# Altium schematic sheet PWR_CHGR.SchDoc
size A4; SheetNumber: 6; SheetTotal: 6; SheetSize: A4; DrawingNumber: SCH-002; SPICEModelCacheCAOXICTU: <root> / <DocumentId>CAOXICTU</DocumentId> / <CacheFrame Number="0"> / <Model Name="led0" Kind="MDL"> / <Text>*Typ INFRARED GaAs LED: Vf=1.2V Vr=5V If=40mA trr=3uS / *LED Pinout: 1=A, 2=K / .MODEL LED0 D (IS=93.5P RS=84M N=2.63 BV=5 IBV=10U / + CJO=2.97P VJ=.75 M=.333 TT=4.32U)</Text> / </Model> / </CacheFrame> / </root>
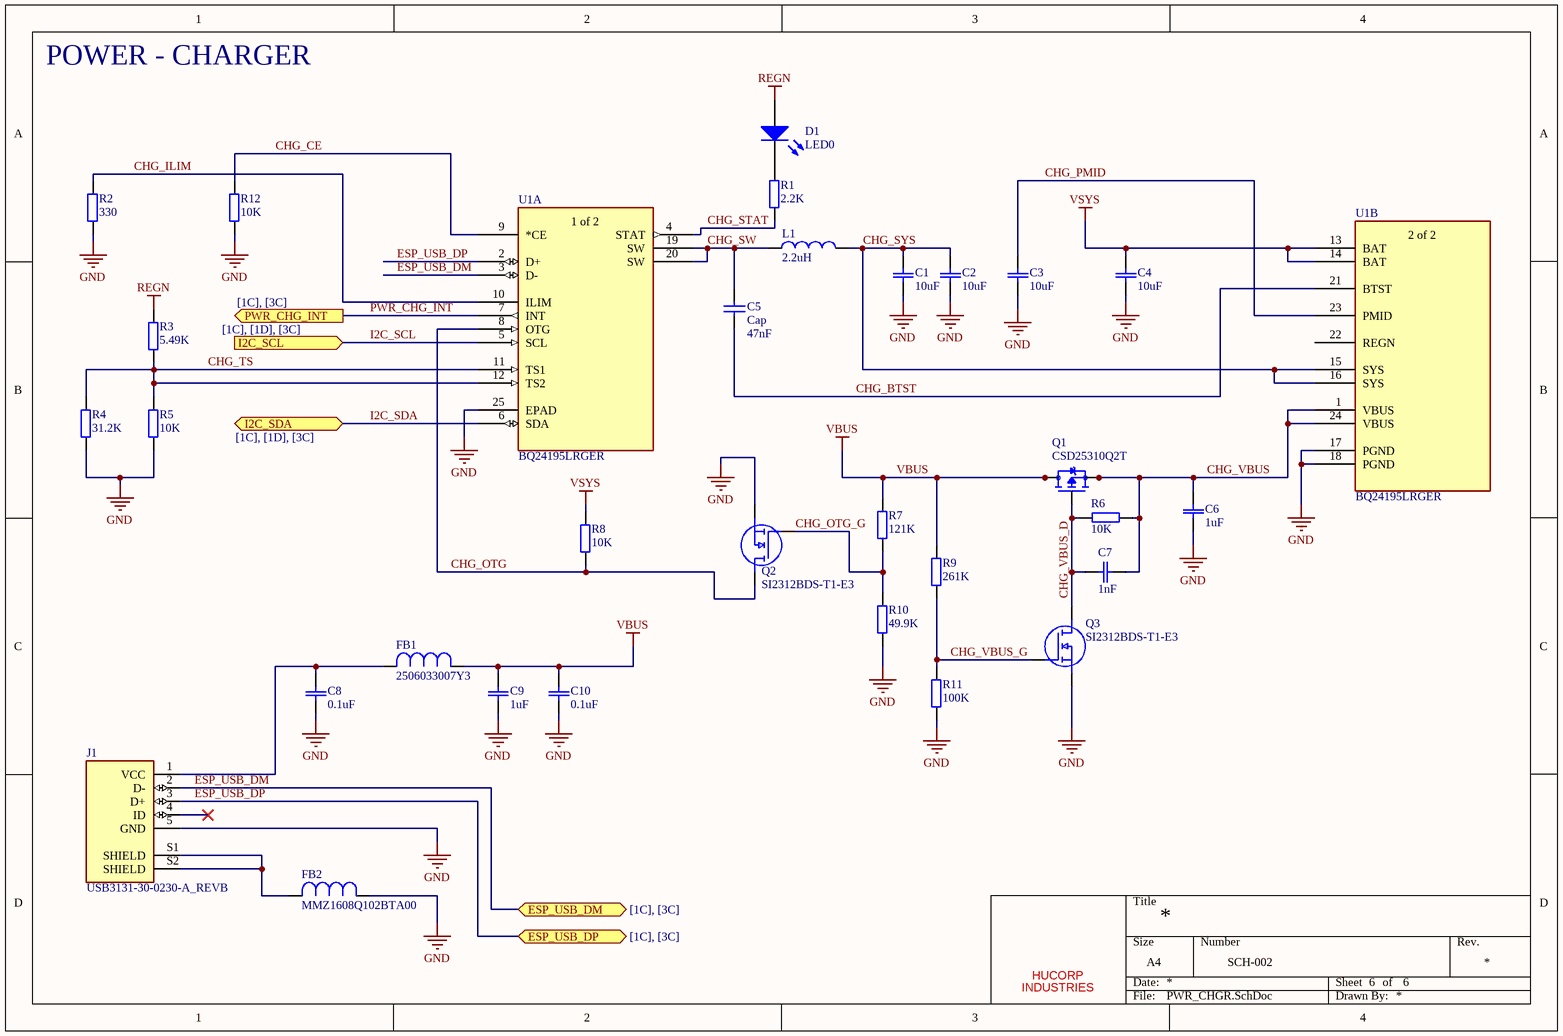
[diagram p0: PWR_CHGR.SchDoc]

## Parts
*  HUCORP  (value not drawn)  (graphical)
C1  value 10uF  [CAP_CL10_SAM]  (hidden comment: 10 uF)
C2  value 10uF  [CAP_CL10_SAM]  (hidden comment: 10 uF)
C3  value 10uF  [CAP_CL10_SAM]  (hidden comment: 10 uF)
C4  value 10uF  [CAP_CL10_SAM]  (hidden comment: 10 uF)
C5  Cap  value 47nF  [RAD-0.3]
C6  1uF  [CAP_CL10_SAM]
C7  value 1nF  [CAP_CL10_SAM]  (hidden comment: 1 nF)
C8  value 0.1uF  [CAP_CL10_SAM]  (hidden comment: 100 nF)
C9  1uF  [CAP_CL10_SAM]
C10  value 0.1uF  [CAP_CL10_SAM]  (hidden comment: 100 nF)
D1  LED0  [LED-0]
FB1  2506033007Y3  [IND_25_0603_FRT]
FB2  MMZ1608Q102BTA00  [IND_1608_TDK]
J1  USB3131-30-0230-A_REVB  [GCT_USB3131-30-0230-A_REVB]
L1  value 2.2uH  [INDC2520X100N]  (hidden comment: DFE252010P-2R2M=P2)
Q1  CSD25310Q2T  [TRANS_CSD25310Q2T]
Q2  SI2312BDS-T1-E3  [SOT95P237X112-3N]
Q3  SI2312BDS-T1-E3  [SOT95P237X112-3N]
R1  value 2.2K  [RC0603N_YAG]  (hidden comment: RC0603FR-072K2L)
R2  value 330  [RES_RC0603_YAG]  (hidden comment: RC0603FR-13330RL)
R3  value 5.49K  [RC0603N_YAG]  (hidden comment: RC0603FR-075K49L)
R4  value 31.2K  [RESC1608X55N]  (hidden comment: RT0603DRE0731K2L)
R5  10K  [RES_RC0603_YAG]
R6  10K  [RES_RC0603_YAG]
R7  value 121K  [RC0603N_YAG]  (hidden comment: RC0603FR-07121KL)
R8  10K  [RES_RC0603_YAG]
R9  value 261K  [RC0603N_YAG]  (hidden comment: RC0603FR-07261KL)
R10  value 49.9K  [RES_RC0603_YAG]  (hidden comment: RC0603FR-1049K9L)
R11  100K  [RC0603N_YAG]
R12  10K  [RES_RC0603_YAG]
U1  BQ24195LRGER  [RGE24_2P7X2P7_TEX]  (parts A,B of 2)

## Ports
ESP_USB_DM (bidir, see [1C], [3C]), ESP_USB_DP (bidir, see [1C], [3C]), I2C_SCL (in, see [1C], [1D], [3C]), I2C_SDA (bidir, see [1C], [1D], [3C]), PWR_CHG_INT (out, see [1C], [3C])

## Nets
GND: C1.1 C2.1 C3.1 C4.1 C6.1 C8.1 C9.1 C10.1 FB2.1 J1.5(GND) Q2.2(S) Q3.2(S) R2.1 R4.1 R5.1 R10.1 R11.1 R12.1 U1.17(PGND) U1.18(PGND) U1.25(EPAD)
REGN: D1.1(A) R3.2
VBUS: C9.2 C10.2 FB1.1 Q1.4(D) Q1.8(D) R7.2 R9.2
VSYS: C4.2 R8.2 U1.13(BAT) U1.14(BAT)
CHG_BTST: C5.1 U1.21(BTST)
CHG_CE: R12.2 U1.9(*CE)
CHG_ILIM: R2.2 U1.10(ILIM)
CHG_OTG: Q2.3(D) R8.1 U1.8(OTG)
CHG_OTG_G: Q2.1(G) R7.1 R10.2
CHG_PMID: C3.2 U1.23(PMID)
CHG_STAT: R1.1 U1.4(STAT)
CHG_SW: C5.2 L1.1 U1.19(SW) U1.20(SW)
CHG_SYS: C1.2 C2.2 L1.2 U1.15(SYS) U1.16(SYS)
CHG_TS: R3.1 R4.2 R5.2 U1.11(TS1) U1.12(TS2)
CHG_VBUS: C6.2 C7.2 Q1.1(S) Q1.2(S) Q1.5(S) Q1.6(S) Q1.7(S) R6.2 U1.1(VBUS) U1.24(VBUS)
CHG_VBUS_D: C7.1 Q1.3(G) Q3.3(D) R6.1
CHG_VBUS_G: Q3.1(G) R9.1 R11.2
ESP_USB_DM: J1.2(D-) U1.3(D-) ; port ESP_USB_DM
ESP_USB_DP: J1.3(D+) U1.2(D+) ; port ESP_USB_DP
I2C_SCL: U1.5(SCL) ; port I2C_SCL
I2C_SDA: U1.6(SDA) ; port I2C_SDA
PWR_CHG_INT: U1.7(INT) ; port PWR_CHG_INT
NetC8_2: C8.2 FB1.2 J1.1(VCC)
NetD1_2: D1.2(K) R1.2
NetFB2_2: FB2.2 J1.S1(SHIELD) J1.S2(SHIELD)

Not connected (* = marked no-connect by the designer): J1 4(ID)*; U1 22(REGN)

## Notes on the sheet
- POWER - CHARGER
- (in symbol BQ24195LRGER, part A) 1 of 2
- (in symbol BQ24195LRGER, part B) 2 of 2
- (in symbol TitleBlock1) Title; Size; Number; Rev.; INDUSTRIES; Date:; Sheet; of; File:; Drawn By:

## Library data of the parts
* = TitleBlock1: HUCORP Title Block
C1-C4 = CL10A106MQ8NNNC: 10 µF ±20% 6.3V Ceramic Capacitor X5R 0603 (1608 Metric); Mfr_Name: Samsung; Type: DEV; Copyright: Copyright (C) 2022 Ultra Librarian. All rights reserved.; Manufacturer_Part_Number: CL10A106MQ8NNNC; Digi-Key_Part_Number_1: 1276-1119-2-ND; Digi-Key_Part_Number_2: 1276-1119-1-ND; Digi-Key_Part_Number_3: 1276-1119-6-ND; RefDes: RefDes
C5 = Cap: Capacitor; Published: 8-Jun-2000; LatestRevisionDate: 17-Jul-2002; LatestRevisionNote: Re-released for DXP Platform.; PackageReference: RAD-0.3; Publisher: Altium Limited; PackageDescription: Radial Cap, Thru-Hole; 2 Leads; 0.3 in Pin Spacing
C6 C9 = CL10A105KA8NNNC: CAP CER 1UF 25V X5R 0603; Mfr_Name: Samsung; Manufacturer_Part_Number: CL10B104KA8NNNC; Type: DEV; Copyright: Copyright (C) 2022 Ultra Librarian. All rights reserved.; Digi-Key_Part_Number_1: 1276-1006-2-ND; Digi-Key_Part_Number_2: 1276-1006-1-ND; Digi-Key_Part_Number_3: 1276-1006-6-ND; RefDes: RefDes; Value: 1uF
C7 = CL10B102KB8NFNC: CAP CER 1nF 50V X7R 0603; Mfr_Name: Samsung; Type: DEV; Copyright: Copyright (C) 2023 Ultra Librarian. All rights reserved.; Manufacturer_Part_Number: CL10B102KB8NFNC; Digi-Key_Part_Number_1: 1276-1914-2-ND; Digi-Key_Part_Number_2: 1276-1914-1-ND; Digi-Key_Part_Number_3: 1276-1914-6-ND; RefDes: RefDes
C8 C10 = CL10B104KA8NNNC: CAP CER 0.1UF 25V X7R 0603; Mfr_Name: Samsung; Type: DEV; Copyright: Copyright (C) 2022 Ultra Librarian. All rights reserved.; Manufacturer_Part_Number: CL10B104KA8NNNC; Digi-Key_Part_Number_1: 1276-1006-2-ND; Digi-Key_Part_Number_2: 1276-1006-1-ND; Digi-Key_Part_Number_3: 1276-1006-6-ND; RefDes: RefDes
D1 = LED0: Typical INFRARED GaAs LED; Published: 8-Jun-2000; LatestRevisionDate: 08-Jul-2005; LatestRevisionNote: Mech Layer 1 removed.; PackageReference: LED-0; Publisher: Altium Limited; PackageDescription: LED; 2 Leads
FB1 = 2506033007Y3: FERRITE BEAD 30 OHM 0603 1LN; Mfr_Name: Fair-Rite; Type: DEV; Copyright: Copyright (C) 2023 Ultra Librarian. All rights reserved.; Manufacturer_Part_Number: 2506033007Y3; Digi-Key_Part_Number_1: 1934-1439-1-ND; Digi-Key_Part_Number_2: 1934-1439-2-ND; Digi-Key_Part_Number_3: 1934-1439-6-ND; RefDes: RefDes
FB2 = MMZ1608Q102BTA00: FERRITE BEAD 1K OHM 0603 1LN; Mfr_Name: TDK; Type: DEV; Copyright: Copyright (C) 2023 Ultra Librarian. All rights reserved.; Manufacturer_Part_Number: MMZ1608Q102BTA00; Digi-Key_Part_Number_1: 445-8680-1-ND; Digi-Key_Part_Number_2: 445-8680-2-ND; Digi-Key_Part_Number_3: 445-8680-6-ND; RefDes: RefDes
J1 = USB3131-30-0230-A_REVB: USB - micro B USB 2.0 Receptacle Connector 5 Position Through Hole; Availability: Unavailable; MP: USB3131-30-0230-A_REVB; Value: *; Package: None; Price: None
L1 = DFE252010P-2R2M=P2: Inductor with Inductance: 2.2uH Tol. +/-20%, Package: 1008 (2520); MF: Murata Electronics; MP: DFE252010P-2R2M=P2; Purchase-URL: https://pricing.snapeda.com/search/part/DFE252010P-2R2M=P2/?ref=eda; Check_prices: https://www.snapeda.com/parts/DFE252010P-2R2M=P2/Murata%20Electronics%20North%20America/view-part/1503972/?ref=eda; Package: 2520 Murata; Availability: Warning; Price: None; SnapEDA_Link: https://www.snapeda.com/parts/DFE252010P-2R2M=P2/Murata%20Electronics%20North%20America/view-part/1503972/?ref=snap
Q1 = CSD25310Q2T: -20V, P ch NexFET MOSFET, single SON 2x2, 23.9mOhm 6-WSON -55 to 150; MF: Texas Instruments; Digi-Key_Part_Number: 296-50290-2-ND; Value: *; Package: WSON-6 Texas Instruments; Purchase-URL: https://pricing.snapeda.com/search/part/CSD25310Q2T/?ref=eda; Check_prices: https://www.snapeda.com/parts/CSD25310Q2T/Texas+Instruments/view-part/?ref=eda; MP: CSD25310Q2T; SnapEDA_Link: https://www.snapeda.com/parts/CSD25310Q2T/Texas+Instruments/view-part/?ref=snap
Q2 Q3 = SI2312BDS-T1-E3: N-Channel 20 V (D-S) MOSFET; Manufacturer_Name: Vishay; Geometry.Height: 1.12mm; Mouser Part Number: 781-SI2312BDS-E3; Mouser Price/Stock: https://www.mouser.co.uk/ProductDetail/Vishay-Semiconductors/SI2312BDS-T1-E3?qs=jcx%252B0HVgj2b3YhM4OoQ%252BrQ%3D%3D; Manufacturer_Part_Number: SI2312BDS-T1-E3; Datasheet Link: http://www.vishay.com/docs/73235/si2312bds.pdf
R1 = RC0603FR-072K2L: RES 2.2K OHM 1% 1/10W 0603; Mfr_Name: Yageo; Copyright: Copyright (C) 2023 Ultra Librarian. All rights reserved.; Manufacturer_Part_Number: RC0603FR-072K2L; Digi-Key_Part_Number_1: 311-2.20KHRCT-ND; Digi-Key_Part_Number_2: 311-2.20KHRDKR-ND; Digi-Key_Part_Number_3: 311-2.20KHRTR-ND; Digi-Key_Part_Number_4: 311-2.20KHRTR-NDL; RefDes: RefDes; Type: DEV
R2 = RC0603FR-13330RL: RES 330 OHM 1% 1/10W 0603; Mfr_Name: Yageo; Copyright: Copyright (C) 2023 Ultra Librarian. All rights reserved.; Manufacturer_Part_Number: RC0603FR-13330RL; Digi-Key_Part_Number_1: 13-RC0603FR-13330RLTR-ND; Digi-Key_Part_Number_2: 13-RC0603FR-13330RLCT-ND; Digi-Key_Part_Number_3: 13-RC0603FR-13330RLDKR-ND; RefDes: RefDes; Type: DEV
R3 = RC0603FR-075K49L: RES 5.49K OHM 1% 1/10W 0603; Mfr_Name: Yageo; Copyright: Copyright (C) 2023 Ultra Librarian. All rights reserved.; Manufacturer_Part_Number: RC0603FR-075K49L; Digi-Key_Part_Number_1: 311-5.49KHRCT-ND; Digi-Key_Part_Number_2: 311-5.49KHRDKR-ND; Digi-Key_Part_Number_3: 311-5.49KHRTR-ND; RefDes: RefDes; Type: DEV
R4 = RT0603DRE0731K2L: RES 31.2K OHM 0.5% 1/10W 0603; Package: None; Price: None; MP: RT0603DRE0731K2L; Availability: Unavailable
R5 R6 R8 R12 = RC0603JR-1310KL: RES 10K OHM 5% 1/10W 0603; Mfr_Name: Yageo; Copyright: Copyright (C) 2022 Ultra Librarian. All rights reserved.; Manufacturer_Part_Number: RC0603JR-1310KL; Digi-Key_Part_Number_1: 13-RC0603JR-1310KLTR-ND; Digi-Key_Part_Number_2: 13-RC0603JR-1310KLCT-ND; Digi-Key_Part_Number_3: 13-RC0603JR-1310KLDKR-ND; RefDes: RefDes; Type: DEV; Value: 10K
R7 = RC0603FR-07121KL: RES 121K OHM 1% 1/10W 0603; Mfr_Name: Yageo; Copyright: Copyright (C) 2023 Ultra Librarian. All rights reserved.; Manufacturer_Part_Number: RC0603FR-07121KL; Digi-Key_Part_Number_1: 311-121KHRCT-ND; Digi-Key_Part_Number_2: 311-121KHRDKR-ND; Digi-Key_Part_Number_3: 311-121KHRTR-ND; RefDes: RefDes; Type: DEV
R9 = RC0603FR-07261KL: RES 261K OHM 1% 1/10W 0603; Mfr_Name: Yageo; Copyright: Copyright (C) 2023 Ultra Librarian. All rights reserved.; Manufacturer_Part_Number: RC0603FR-07261KL; Digi-Key_Part_Number_1: 311-261KHRCT-ND; Digi-Key_Part_Number_2: 311-261KHRDKR-ND; Digi-Key_Part_Number_3: 311-261KHRTR-ND; RefDes: RefDes; Type: DEV
R10 = RC0603FR-1049K9L: RES 49.9K OHM 1% 1/10W 0603; Mfr_Name: Yageo; Copyright: Copyright (C) 2023 Ultra Librarian. All rights reserved.; Manufacturer_Part_Number: RC0603FR-1049K9L; Digi-Key_Part_Number_1: 13-RC0603FR-1049K9LTR-ND; Digi-Key_Part_Number_2: 13-RC0603FR-1049K9LCT-ND; Digi-Key_Part_Number_3: 13-RC0603FR-1049K9LDKR-ND; RefDes: RefDes; Type: DEV
R11 = RC0603FR-07100KL: RES 100K OHM 1% 1/10W 0603; Mfr_Name: Yageo; Copyright: Copyright (C) 2022 Ultra Librarian. All rights reserved.; Manufacturer_Part_Number: RC0603FR-07100KL; Digi-Key_Part_Number_1: 311-100KHRCT-ND; Digi-Key_Part_Number_2: 311-100KHRDKR-ND; Digi-Key_Part_Number_3: 311-100KHRTR-ND; Digi-Key_Part_Number_4: 311-100KHRTR-NDL; RefDes: RefDes; Type: DEV; Value: 100K
U1 = BQ24195LRGER: IC BATT CHG LI-ION 1CELL 24VQFN; Mfr_Name: Texas Instruments; Copyright: Copyright (C) 2023 Ultra Librarian. All rights reserved.; Manufacturer_Part_Number: BQ24195LRGER; Digi-Key_Part_Number_1: 2156-BQ24195LRGER-ND; Digi-Key_Part_Number_2: 296-49149-1-ND; Digi-Key_Part_Number_3: 296-49149-2-ND; Digi-Key_Part_Number_4: 296-49149-6-ND; Digi-Key_Part_Number_5: BQ24195LRGER-ND; RefDes: RefDes; Type: DEV